# Altium schematic sheet Motor_Control.SchDoc
size 304 x 241 mm; SheetNumber: 3; SheetTotal: 6
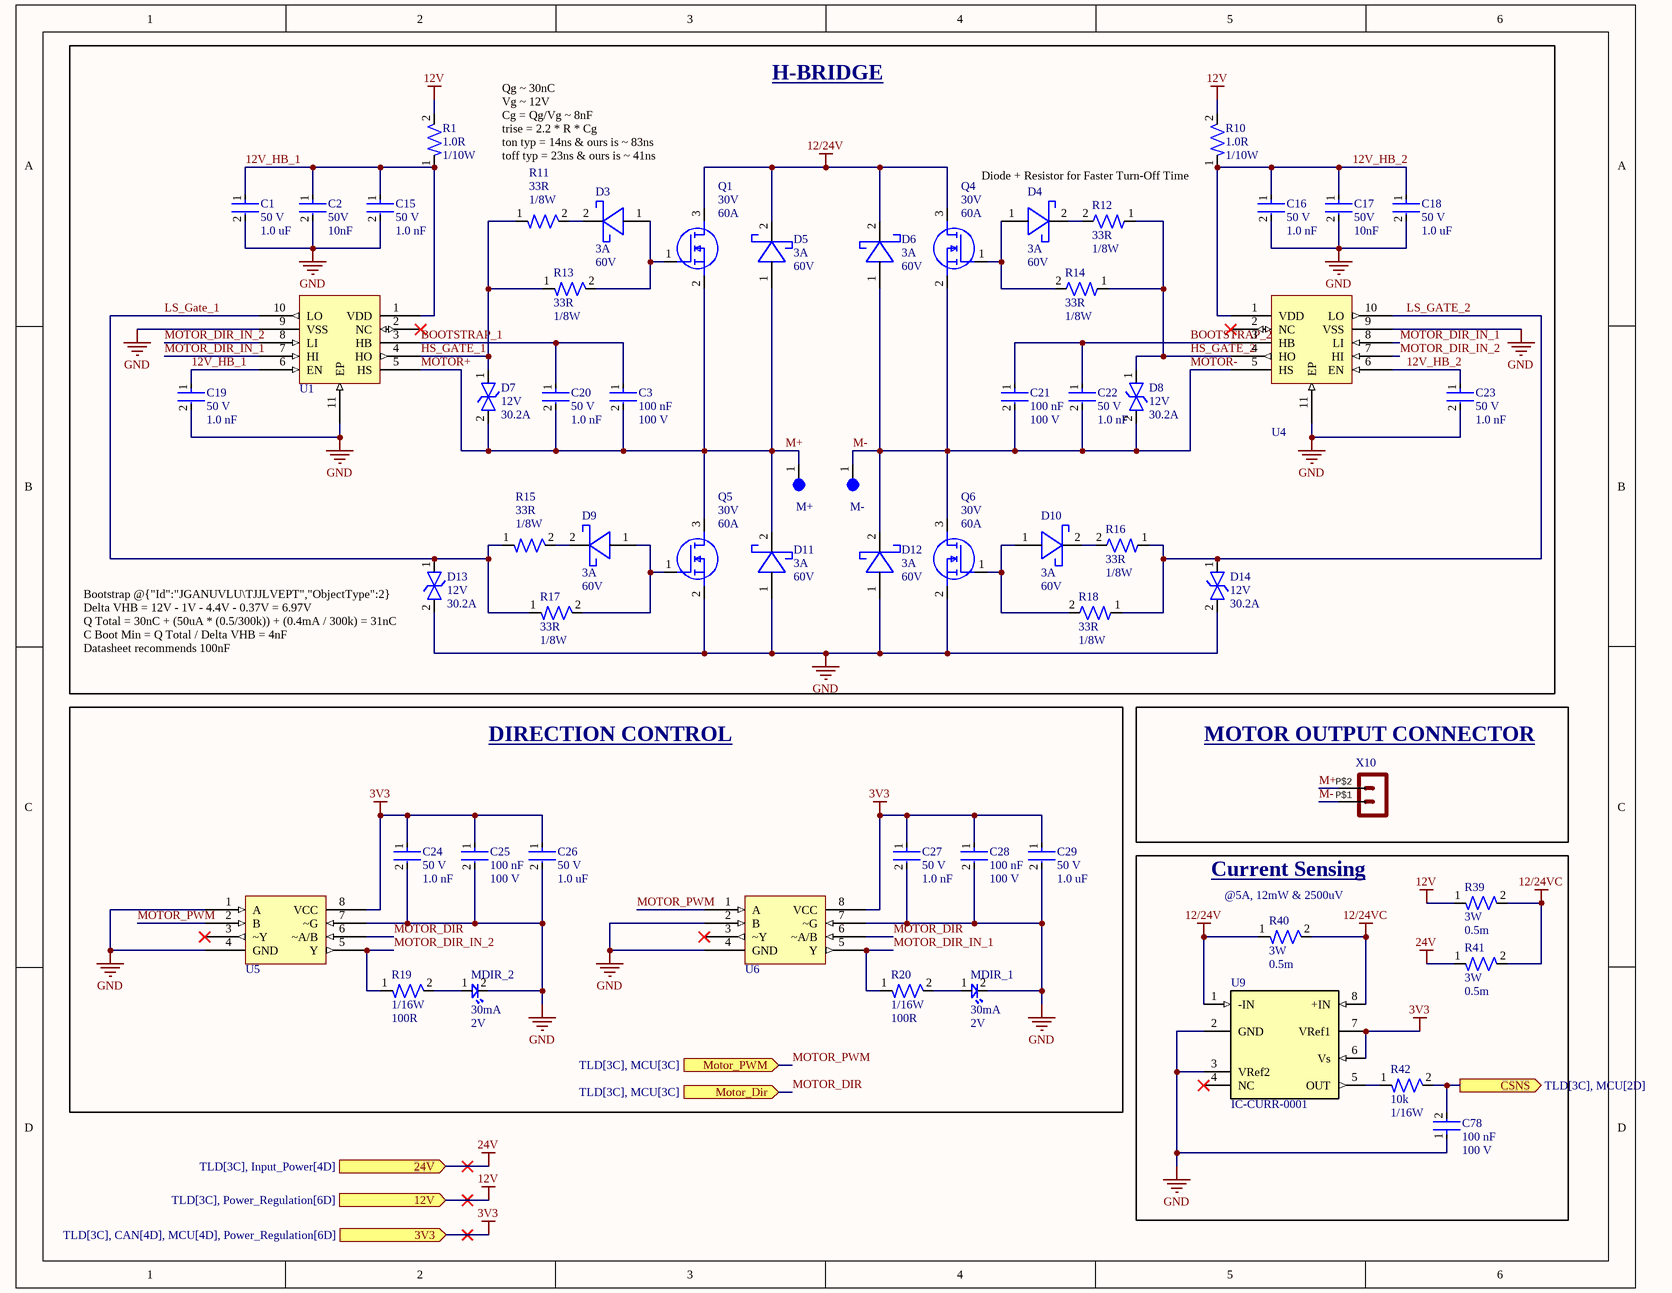
[diagram p0: Motor_Control.SchDoc]

## Parts
C1  Voltage: 50 V  Capacitance: 1.0 uF  [CAP-0805]  (hidden comment: CC0805KKX7R9BB105)
C2  Voltage: 50V  Capacitance: 10nF  [CAP-0805]  (hidden comment: GRM2195C1H103JA01D)
C3  Capacitance: 100 nF  Voltage: 100 V  [CAP-0603]  (hidden comment: CC0603KRX7R0BB104)
C15  Voltage: 50 V  Capacitance: 1.0 nF  [CAP-0402]  (hidden comment: CC0402KRX7R9BB102)
C16  Voltage: 50 V  Capacitance: 1.0 nF  [CAP-0402]  (hidden comment: CC0402KRX7R9BB102)
C17  Voltage: 50V  Capacitance: 10nF  [CAP-0805]  (hidden comment: GRM2195C1H103JA01D)
C18  Voltage: 50 V  Capacitance: 1.0 uF  [CAP-0805]  (hidden comment: CC0805KKX7R9BB105)
C19  Voltage: 50 V  Capacitance: 1.0 nF  [CAP-0402]  (hidden comment: CC0402KRX7R9BB102)
C20  Voltage: 50 V  Capacitance: 1.0 nF  [CAP-0402]  (hidden comment: CC0402KRX7R9BB102)
C21  Capacitance: 100 nF  Voltage: 100 V  [CAP-0603]  (hidden comment: CC0603KRX7R0BB104)
C22  Voltage: 50 V  Capacitance: 1.0 nF  [CAP-0402]  (hidden comment: CC0402KRX7R9BB102)
C23  Voltage: 50 V  Capacitance: 1.0 nF  [CAP-0402]  (hidden comment: CC0402KRX7R9BB102)
C24  Voltage: 50 V  Capacitance: 1.0 nF  [CAP-0402]  (hidden comment: CC0402KRX7R9BB102)
C25  Capacitance: 100 nF  Voltage: 100 V  [CAP-0603]  (hidden comment: CC0603KRX7R0BB104)
C26  Voltage: 50 V  Capacitance: 1.0 uF  [CAP-0805]  (hidden comment: CC0805KKX7R9BB105)
C27  Voltage: 50 V  Capacitance: 1.0 nF  [CAP-0402]  (hidden comment: CC0402KRX7R9BB102)
C28  Capacitance: 100 nF  Voltage: 100 V  [CAP-0603]  (hidden comment: CC0603KRX7R0BB104)
C29  Voltage: 50 V  Capacitance: 1.0 uF  [CAP-0805]  (hidden comment: CC0805KKX7R9BB105)
C78  Capacitance: 100 nF  Voltage: 100 V  [CAP-0603]  (hidden comment: CC0603KRX7R0BB104)
D3  Current Rating: 3A  Reverse Voltage: 60V  [DIO-SOD128]  (hidden comment: PMEG6030EP,115)
D4  Current Rating: 3A  Reverse Voltage: 60V  [DIO-SOD128]  (hidden comment: PMEG6030EP,115)
D5  Current Rating: 3A  Reverse Voltage: 60V  [DIO-SOD128]  (hidden comment: PMEG6030EP,115)
D6  Current Rating: 3A  Reverse Voltage: 60V  [DIO-SOD128]  (hidden comment: PMEG6030EP,115)
D7  Standoff Voltage: 12V  Current Rating: 30.2A  [DO-214AA (SMBJ)]  (hidden comment: SMBJ12CA)
D8  Standoff Voltage: 12V  Current Rating: 30.2A  [DO-214AA (SMBJ)]  (hidden comment: SMBJ12CA)
D9  Current Rating: 3A  Reverse Voltage: 60V  [DIO-SOD128]  (hidden comment: PMEG6030EP,115)
D10  Current Rating: 3A  Reverse Voltage: 60V  [DIO-SOD128]  (hidden comment: PMEG6030EP,115)
D11  Current Rating: 3A  Reverse Voltage: 60V  [DIO-SOD128]  (hidden comment: PMEG6030EP,115)
D12  Current Rating: 3A  Reverse Voltage: 60V  [DIO-SOD128]  (hidden comment: PMEG6030EP,115)
D13  Standoff Voltage: 12V  Current Rating: 30.2A  [DO-214AA (SMBJ)]  (hidden comment: SMBJ12CA)
D14  Standoff Voltage: 12V  Current Rating: 30.2A  [DO-214AA (SMBJ)]  (hidden comment: SMBJ12CA)
M+  5003  [TEST-POINT-0001]  (value not drawn)
M-  5003  [TEST-POINT-0001]  (value not drawn)
MDIR_1  Forward Current: 30mA  Forward Voltage: 2V  [LED-0603]  (hidden comment: BL-HKC36G-AV-TRB)
MDIR_2  Forward Current: 30mA  Forward Voltage: 2V  [LED-0603]  (hidden comment: BL-HKC36G-AV-TRB)
Q1  Voltage: 30V  Continuous Current: 60A  [IC-8VSONCLIP]  (hidden comment: CSD17575Q3)
Q4  Voltage: 30V  Continuous Current: 60A  [IC-8VSONCLIP]  (hidden comment: CSD17575Q3)
Q5  Voltage: 30V  Continuous Current: 60A  [IC-8VSONCLIP]  (hidden comment: CSD17575Q3)
Q6  Voltage: 30V  Continuous Current: 60A  [IC-8VSONCLIP]  (hidden comment: CSD17575Q3)
R1  Resistance: 1.0R  Power: 1/10W  [RES-0402]  (hidden comment: ERJ2GEJ1R0X)
R10  Resistance: 1.0R  Power: 1/10W  [RES-0402]  (hidden comment: ERJ2GEJ1R0X)
R11  Resistance: 33R  Power: 1/8W  [RES-0402]  (hidden comment: RC0402FR-7W33RL)
R12  Resistance: 33R  Power: 1/8W  [RES-0402]  (hidden comment: RC0402FR-7W33RL)
R13  Resistance: 33R  Power: 1/8W  [RES-0402]  (hidden comment: RC0402FR-7W33RL)
R14  Resistance: 33R  Power: 1/8W  [RES-0402]  (hidden comment: RC0402FR-7W33RL)
R15  Resistance: 33R  Power: 1/8W  [RES-0402]  (hidden comment: RC0402FR-7W33RL)
R16  Resistance: 33R  Power: 1/8W  [RES-0402]  (hidden comment: RC0402FR-7W33RL)
R17  Resistance: 33R  Power: 1/8W  [RES-0402]  (hidden comment: RC0402FR-7W33RL)
R18  Resistance: 33R  Power: 1/8W  [RES-0402]  (hidden comment: RC0402FR-7W33RL)
R19  Power: 1/16W  Resistance: 100R  [RES-0402]  (hidden comment: RC0402FR-07100RL)
R20  Power: 1/16W  Resistance: 100R  [RES-0402]  (hidden comment: RC0402FR-07100RL)
R39  Power: 3W  Resistance: 0.5m  [RES-2512]  (hidden comment: C337220)
R40  Power: 3W  Resistance: 0.5m  [RES-2512]  (hidden comment: C337220)
R41  Power: 3W  Resistance: 0.5m  [RES-2512]  (hidden comment: C337220)
R42  Resistance: 10k  Power: 1/16W  [RES-0402]  (hidden comment: RC0402FR-0710KL)
U1  UCC27282DRCR  [IC-10VSON]  (value not drawn)
U4  UCC27282DRCR  [IC-10VSON]  (value not drawn)
U5  SN74LVC2G157DCUR  [IC-8VSSOP]  (value not drawn)
U6  SN74LVC2G157DCUR  [IC-8VSSOP]  (value not drawn)
U9  IC-CURR-0001  [IC-CURR]
X10  Molex - Micro-Fit 3.0 Series connector,  3.00mm (0.118") pitch header, 2 positions.  [43650-0200]  (value not drawn)

## Blocks framed on the sheet
H-BRIDGE: C1-C3 C15-C23 D3-D14 M+ M- Q1 Q4-Q6 R1 R10-R18 U1 U4
DIRECTION CONTROL: C24-C29 MDIR_1 MDIR_2 R19 R20 U5 U6
MOTOR OUTPUT CONNECTOR: X10
Current Sensing: C78 R39-R42 U9

## Ports
3V3 (in, see TLD[3C], CAN[4D], MCU[4D], Power_Regulation[6D]), 12V (in, see TLD[3C], Power_Regulation[6D]), 24V (in, see TLD[3C], Input_Power[4D]), CSNS (out, see TLD[3C], MCU[2D]), Motor_Dir (in, see TLD[3C], MCU[3C]), Motor_PWM (in, see TLD[3C], MCU[3C])

## Nets
3V3: C24.1 C25.1 C26.1 C27.1 C28.1 C29.1 U5.8(VCC) U6.8(VCC) U9.6(Vs) U9.7(VRef1) ; port 3V3
12/24V: D5.2(ANODE) D6.2(ANODE) Q1.3(D) Q4.3(D) R40.1 U9.1(-IN)
12/24VC: R39.2 R40.2 R41.2 U9.8(+IN)
12V: R1.2 R10.2 R39.1 ; port 12V
24V: R41.1 ; port 24V
GND: C1.2 C2.2 C15.2 C16.2 C17.2 C18.2 C19.2 C23.2 C24.2 C25.2 C26.2 C27.2 C28.2 C29.2 C78.1 D11.1(CATHODE) D12.1(CATHODE) D13.2 D14.2 MDIR_1.2 MDIR_2.2 Q5.2(S) Q6.2(S) U1.9(VSS) U1.11(EP) U4.9(VSS) U4.11(EP) U5.1(A) U5.4(GND) U5.7(~G) U6.2(B) U6.4(GND) U6.7(~G) U9.2(GND) U9.3(VRef2)
12V_HB_1: C1.1 C2.1 C15.1 C19.1 R1.1 U1.1(VDD) U1.6(EN)
12V_HB_2: C16.1 C17.1 C18.1 C23.1 R10.1 U4.1(VDD) U4.6(EN)
BOOTSTRAP_1: C3.1 C20.1 U1.3(HB)
BOOTSTRAP_2: C21.1 C22.1 U4.3(HB)
CSNS: C78.2 R42.2 ; port CSNS
HS_GATE_1: D7.1 R11.1 R13.1 U1.4(HO)
HS_GATE_2: D8.1 R12.1 R14.1 U4.4(HO)
LS_Gate_1: D13.1 R15.1 R17.1 U1.10(LO)
LS_GATE_2: D14.1 R16.1 R18.1 U4.10(LO)
M+: C3.2 C20.2 D5.1(CATHODE) D7.2 D11.2(ANODE) M+.1 Q1.2(S) Q5.3(D) U1.5(HS) X10.P$2  [also labelled MOTOR+]
M-: C21.2 C22.2 D6.1(CATHODE) D8.2 D12.2(ANODE) M-.1 Q4.2(S) Q6.3(D) U4.5(HS) X10.P$1  [also labelled MOTOR-]
MOTOR_DIR: U5.6(~A/B) U6.6(~A/B) ; port Motor_Dir
MOTOR_DIR_IN_1: R20.1 U1.7(HI) U4.8(LI) U6.5(Y)
MOTOR_DIR_IN_2: R19.1 U1.8(LI) U4.7(HI) U5.5(Y)
MOTOR_PWM: U5.2(B) U6.1(A) ; port Motor_PWM
NetD3_1: D3.1(CATHODE) Q1.1(G) R13.2
NetD3_2: D3.2(ANODE) R11.2
NetD4_1: D4.1(CATHODE) Q4.1(G) R14.2
NetD4_2: D4.2(ANODE) R12.2
NetD9_1: D9.1(CATHODE) Q5.1(G) R17.2
NetD9_2: D9.2(ANODE) R15.2
NetD10_1: D10.1(CATHODE) Q6.1(G) R18.2
NetD10_2: D10.2(ANODE) R16.2
NetMDIR_1_1: MDIR_1.1 R20.2
NetMDIR_2_1: MDIR_2.1 R19.2
NetR42_1: R42.1 U9.5(OUT)

Not connected (* = marked no-connect by the designer): U1 2(NC)*; U4 2(NC)*; U5 3(~Y)*; U6 3(~Y)*; U9 4(NC)*

## Notes on the sheet
- Qg ~ 30nC
  Vg ~ 12V
  Cg = Qg/Vg ~ 8nF
  trise = 2.2 * R * Cg
  ton typ = 14ns & ours is ~ 83ns
  toff typ = 23ns & ours is ~ 41ns
- (near R10) Diode + Resistor for Faster Turn-Off Time
- (near D13) Bootstrap @{"Id":"JGANUVLU\TJJLVEPT","ObjectType":2}
  Delta VHB = 12V - 1V - 4.4V - 0.37V = 6.97V
  Q Total = 30nC + (50uA * (0.5/300k)) + (0.4mA / 300k) = 31nC
  C Boot Min = Q Total / Delta VHB = 4nF
  Datasheet recommends 100nF
- (near R40) @5A, 12mW & 2500uV

## Library data of the parts
C1 C18 C26 C29 = CAP-1U-0001: CAP CER 1UF 50V X7R 0805; ComponentLink2URL: https://www.yageo.com/upload/media/product/productsearch/datasheet/mlcc/UPY-GPHC_X7R_6.3V-to-250V_24.pdf; ComponentLink2Description: Datasheet; Device Class: Ceramic; Size: 0805
C2 C17 = CAP-10N-0001: CAP CER 10000PF 50V C0G/NP0 0805; Device Class: Ceramic; Size: 0805; ComponentLink1Description: Datasheet; ComponentLink1URL: https://search.murata.co.jp/Ceramy/image/img/A01X/G101/ENG/GRM2195C1H103JA01-01.pdf
C3 C21 C25 C28 C78 = CAP-100N-0001: CAP CER 0.1UF 100V X7R 0603; Device Class: Ceramic; Size: 0603; ComponentLink1Description: Datasheet; ComponentLink1URL: https://www.yageo.com/upload/media/product/app/datasheet/mlcc/upy-np0x7r_mv_100-to-630v.pdf
C15 C16 C19 C20 C22-C24 C27 = CAP-1N-0001: CAP CER 1000PF 50V X7R 0402; ComponentLink2Description: Datasheet; ComponentLink2URL: http://www.yageo.com/documents/recent/UPY-GP_NP0_16V-to-50V_16.pdf; Device Class: Ceramic; Size: 0402
D3-D6 D9-D12 = DIO-SCHOTTKY-0003: DIODE SCHOTTKY 60V 3A SOD128; ComponentLink1Description: Datasheet; ComponentLink1URL: https://assets.nexperia.com/documents/data-sheet/PMEG6030EP.pdf
D7 D8 D13 D14 = DIO-TVS-0002: TVS DIODE 12VWM 19.9VC DO214AA; ComponentLink1Description: Datasheet; ComponentLink1URL: https://www.littelfuse.com/media?resourcetype=datasheets&itemid=09a6ae9a-73cb-4ac4-acac-e6dab92ab953&filename=littelfuse_tvs_diode_smbj_datasheet.pdf
M+ M- = TEST-POINT-0001: Oranange PC Test Point, Miniature Phoisphor Bronze Silver Plating Through Hole Mounting Type
MDIR_1 MDIR_2 = LED-0001: LED YELLOW CLEAR 0603 SMD; ComponentLink1Description: Datasheet; ComponentLink1URL: https://www.americanbrightled.com/pdffiles/led-components/smt/BL-HKC36G-AV-TRB.pdf
Q1 Q4-Q6 = NMOS-26A-0001: MOSFET N-CH 30V 60A 8VSON; ComponentLink1Description: Datasheet; ComponentLink1URL: https://www.ti.com/lit/ds/symlink/csd17575q3.pdf?ts=1728565072242&ref_url=https%253A%252F%252Fwww.mouser.co.uk%252F
R1 R10 = RES-1-0001: RES SMD 1 OHM 5% 1/10W 0402; Tolerance: 5%; ComponentLink1Description: Datasheet; ComponentLink1URL: https://api.pim.na.industrial.panasonic.com/file_stream/main/fileversion/1242; Size: 0402
R11-R18 = RES-33-0001: RES 33 OHM 1% 1/8W 0402; Tolerance: 1%; Size: 0402; ComponentLink1Description: Datasheet; ComponentLink1URL: https://www.yageo.com/upload/media/product/products/datasheet/rchip/PYu-RC_Group_51_RoHS_L_12.pdf
R19 R20 = RES-100-0001: RES 100 OHM 1% 1/16W 0402; Tolerance: 1%; Size: 0402; ComponentLink1Description: Datasheet; ComponentLink1URL: https://www.yageo.com/upload/media/product/products/datasheet/rchip/PYu-RC_Group_51_RoHS_L_12.pdf
R39-R41 = RES-0.5m-0001: 2512 Chip Resistor - Surface Mount ROHS; Tolerance: 1%; Size: 0402; ComponentLink1Description: Datasheet; ComponentLink1URL: https://www.yageo.com/upload/media/product/products/datasheet/rchip/PYu-RC_Group_51_RoHS_L_12.pdf
R42 = RES-10k-0001: RES 10K OHM 1% 1/16W 0402; Tolerance: 1%; Size: 0402; ComponentLink1Description: Datasheet; ComponentLink1URL: https://www.yageo.com/upload/media/product/products/datasheet/rchip/PYu-RC_Group_51_RoHS_L_12.pdf
U1 U4 = IC-GTDR-0001: IC GATE DRVR HALF-BRIDGE 10VSON; VCC Max: 16; Package: 10-VSON; ComponentLink1Description: Datasheet; ComponentLink1URL: https://www.ti.com/lit/ds/symlink/ucc27282.pdf?HQS=dis-dk-null-digikeymode-dsf-pf-null-wwe&ts=1728563165008&ref_url=https%253A%252F%252Fwww.ti.com
U5 U6 = IC-MUX-0001: Multiplexer 1 x 2:1 8-VSSOP; ComponentLink1Description: Datasheet; ComponentLink1URL: https://www.ti.com/general/docs/suppproductinfo.tsp?distId=10&gotoUrl=https%3A%2F%2Fwww.ti.com%2Flit%2Fgpn%2Fsn74lvc2g157
U9 = IC-CURR-0001: Current Sense Amplifier 1 Circuit 8-MSOP
X10 = HEADER_POS2_?43650-0200